# EAGLE design feld_hw (EAGLE 6.6.0)
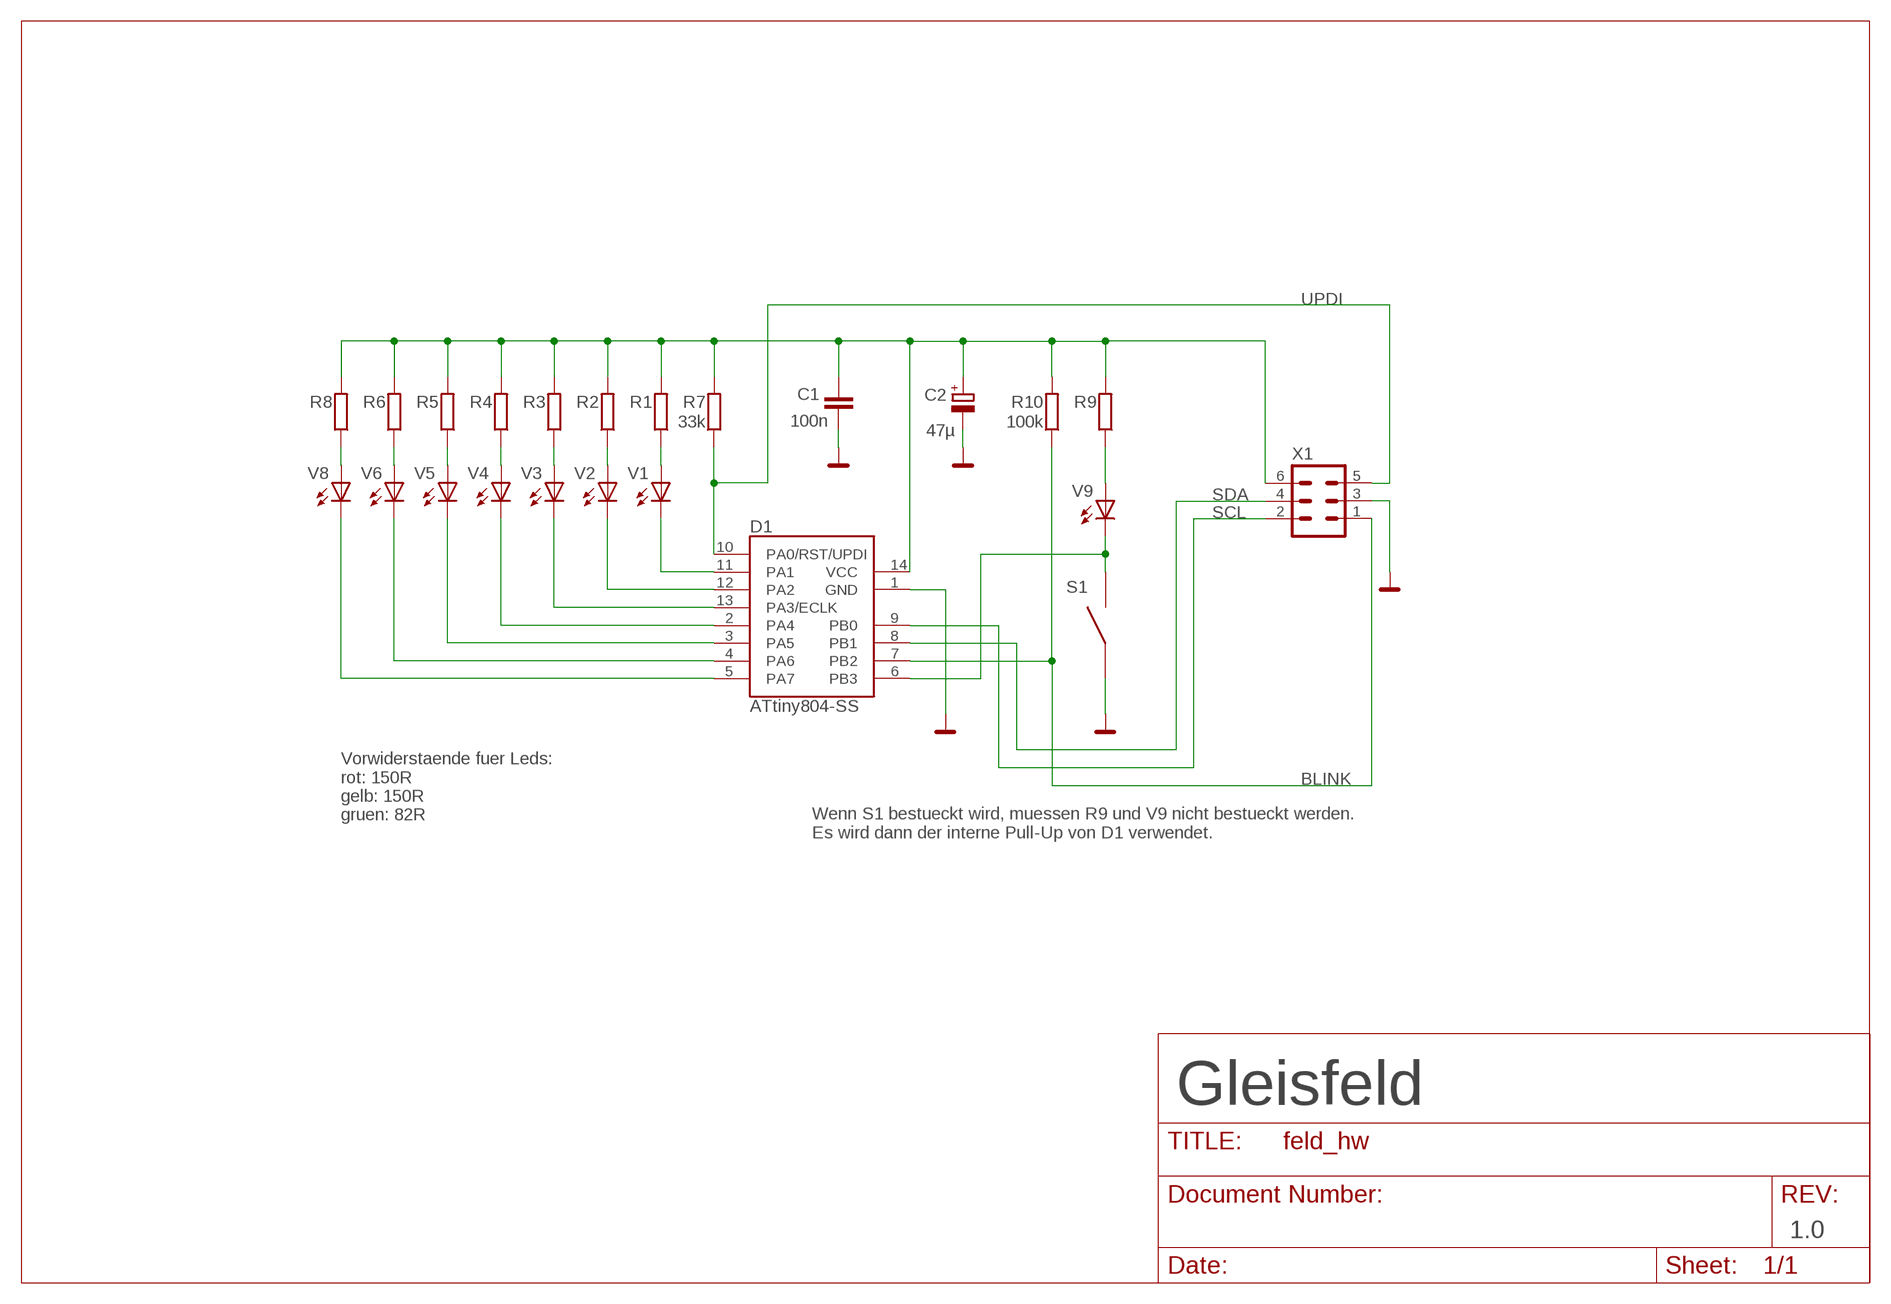
[diagram p0: schematic, sheet 1]

## Parts
C1  100n  C-EUC0805  [C0805]
C2  47µ  CPOL-EUCT7343  [CT7343]
D1  ATtiny804-SS  ATTINY204  [SOIC14]
R1  R-EU_R0805  [R0805]
R2  R-EU_R0805  [R0805]
R3  R-EU_R0805  [R0805]
R4  R-EU_R0805  [R0805]
R5  R-EU_R0805  [R0805]
R6  R-EU_R0805  [R0805]
R7  33k  R-EU_R0805  [R0805]
R8  R-EU_R0805  [R0805]
R9  R-EU_R0805  [R0805]
R10  100k  R-EU_R0805  [R0805]
S1  800SP9B5M2QEH  [ST811004]
V1  LEDPAD  [LED3MMPAD]
V2  LEDPAD  [LED3MMPAD]
V3  LEDPAD  [LED3MMPAD]
V4  LEDPAD  [LED3MMPAD]
V5  LEDPAD  [LED3MMPAD]
V6  LEDPAD  [LED3MMPAD]
V8  LEDPAD  [LED3MMPAD]
V9  LEDPAD  [LED3MMPAD]
X1  PINH2X3N  [MA03/2]

## Nets
BLINK: D1.7(PB2) R10.1 X1.1
GND: C1.1 C2.- D1.1(GND) S1.1 X1.3
N$1: D1.5(PA7) V8.P$2(C)
N$2: D1.4(PA6) V6.P$2(C)
N$3: D1.3(PA5) V5.P$2(C)
N$4: D1.2(PA4) V4.P$2(C)
N$5: D1.13(PA3/ECLK) V3.P$2(C)
N$6: D1.12(PA2) V2.P$2(C)
N$7: D1.11(PA1) V1.P$2(C)
N$8: R8.1 V8.P$1(A)
N$9: R6.1 V6.P$1(A)
N$10: R5.1 V5.P$1(A)
N$11: R4.1 V4.P$1(A)
N$12: R3.1 V3.P$1(A)
N$13: R2.1 V2.P$1(A)
N$14: R1.1 V1.P$1(A)
N$16: C1.2 C2.+ D1.14(VCC) R1.2 R2.2 R3.2 R4.2 R5.2 R6.2 R7.2 R8.2 R9.2 R10.2 X1.6
N$17: D1.6(PB3) S1.2 V9.P$2(C)
N$18: R9.1 V9.P$1(A)
SCL: D1.9(PB0) X1.2
SDA: D1.8(PB1) X1.4
UPDI: D1.10(PA0/RST/UPDI) R7.1 X1.5

## Notes on the sheet
- Vorwiderstaende fuer Leds:
  rot: 150R
  gelb: 150R
  gruen: 82R
- Wenn S1 bestueckt wird, muessen R9 und V9 nicht bestueckt werden.
  Es wird dann der interne Pull-Up von D1 verwendet.
- Gleisfeld
- 1.0

## Library data of the parts
C1 = rclwolfi:C-EU: CAPACITOR, European symbol
C2 = rclwolfi:CPOL-EU: POLARIZED CAPACITOR, European symbol
D1 = wolfi:ATTINY204
R1-R10 = rclwolfi:R-EU_: RESISTOR, European symbol
S1 = wolfi:800SP9B5M2QEH: E-Switch Series 800 Switch <https://www.e-switch.com/system/asset/product_line/data_sheet/29/800.pdf>
V1-V6 V8 V9 = opto:LED: LED OSRAM: - CHIPLED LG R971, LG N971, LY N971, LG Q971, LY Q971, LO R971, LY R971 LH N974, LH R974 LS Q976, LO Q976, LY Q976 LO Q996 - Hyper CHIPLED LW Q18S LB Q993, LB Q99A, LB R99A - SideLED LS A670, LO A670, LY A670, LG A670, LP A670 LB A673, LV A673, LT A673, LW A673 LH A674 LY A675 LS A676, LA A676, LO A676, LY A676, LW A676 LS A679, LY A679, LG A679 - Hyper Micro SIDELED® LS Y876, LA Y876, LO Y876, LY Y876 LT Y87S - SmartLED LW L88C, LW L88S LB L89C, LB L89S, LG L890 LS L89K, LO L89K, LY L89K LS L896, LA L896, LO L896, LY L896 - TOPLED LS T670, LO T670, LY T670, LG T670, LP T670 LSG T670, LSP T670, LSY T670, LOP T670, LYG T670 LG T671, LOG T671, LSG T671 LB T673, LV T673, LT T673, LW T673 LH T674 LS T676, LA T676, LO T676, LY T676, LB T676, LH T676, LSB T676, LW T676 LB T67C, LV T67C, LT T67C, LS T67K, LO T67K, LY T67K, LW E67C LS E67B, LA E67B, LO E67B, LY E67B, LB E67C, LV E67C, LT E67C LW T67C LS T679, LY T679, LG T679 LS T770, LO T770, LY T770, LG T770, LP T770 LB T773, LV T773, LT T773, LW T773 LH T774 LS E675, LA E675, LY E675, LS T675 LS T776, LA T776, LO T776, LY T776, LB T776 LHGB T686 LT T68C, LB T68C - Hyper Mini TOPLED® LB M676 - Mini TOPLED Santana® LG M470 LS M47K, LO M47K, LY M47K Source: http://www.osram.convergy.de LUXEON: - LUMILED® LXK2-PW12-R00, LXK2-PW12-S00, LXK2-PW14-U00, LXK2-PW14-V00 LXK2-PM12-R00, LXK2-PM12-S00, LXK2-PM14-U00 LXK2-PE12-Q00, LXK2-PE12-R00, LXK2-PE12-S00, LXK2-PE14-T00, LXK2-PE14-U00 LXK2-PB12-K00, LXK2-PB12-L00, LXK2-PB12-M00, LXK2-PB14-N00, LXK2-PB14-P00, LXK2-PB14-Q00 LXK2-PR12-L00, LXK2-PR12-M00, LXK2-PR14-Q00, LXK2-PR14-R00 LXK2-PD12-Q00, LXK2-PD12-R00, LXK2-PD12-S00 LXK2-PH12-R00, LXK2-PH12-S00 LXK2-PL12-P00, LXK2-PL12-Q00, LXK2-PL12-R00 Source: www.luxeon.com KINGBRIGHT: KA-3528ASYC Source: www.kingbright.com
X1 = wolfi:PINH2X3

## Board
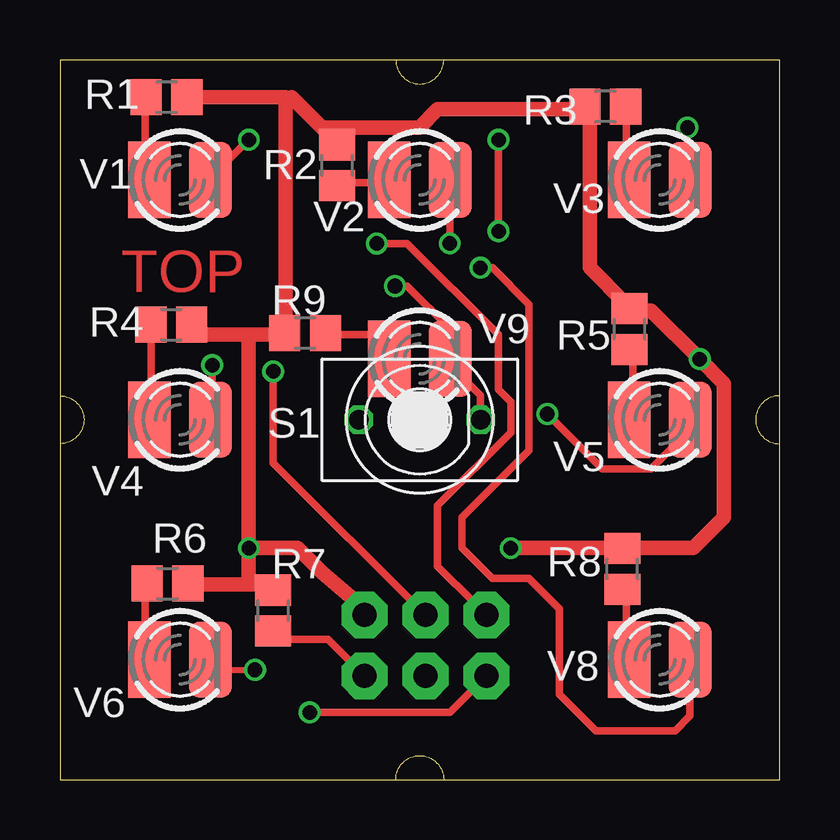
[diagram p1: board, top side]
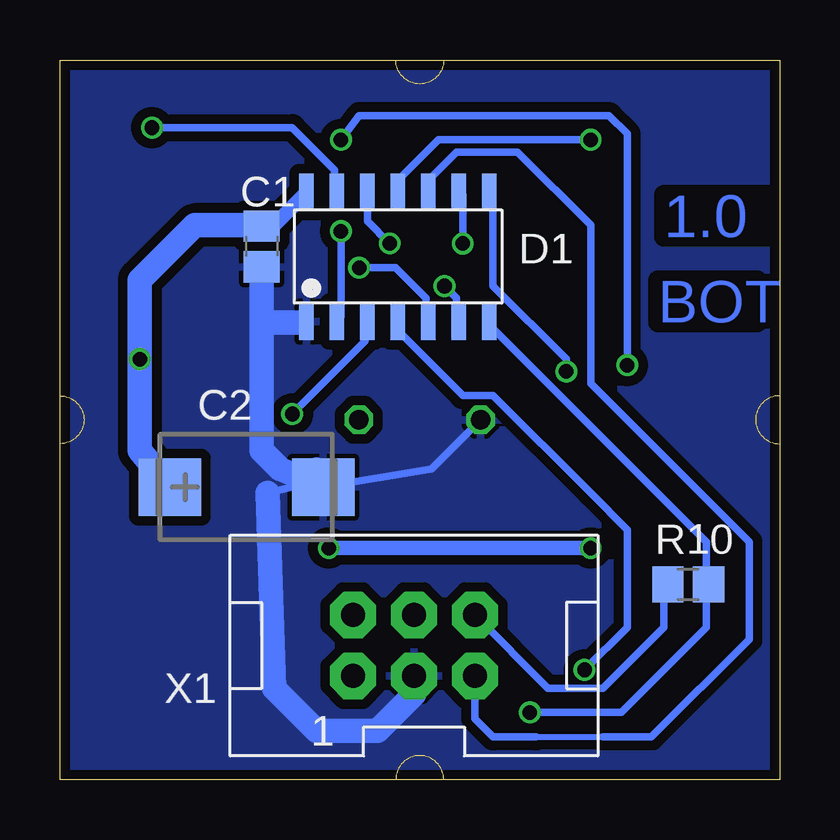
[diagram p2: board, bottom side, seen from below]

Size 30 x 30 mm. Coordinates in mm from the lower left corner, seen from the top.
Outline: 0,0 30,0 30,30 16,30 14,30 0,30 0,0
Copper layers (1*16): Top 0.018mm / dielectric 1.55mm / Bottom 0.018mm
Design rules "Multi-CB_2L_100Âµm-Tracks_OL35Âµm": minimum track width 0.1mm, minimum drill 0.2mm, track to track 0.1mm, track to pad 0.1mm, pad to pad 0.1mm, via to via 0.1mm, smd to smd 0mil, copper to edge 0.2mm, drill to drill 0.2mm, minimum pad ring 0.125mm, minimum via ring 0.1mm, stop-mask expansion 2mil, vias tented up to drill 0.45mm, thermal gap 0.2mm
Milling: 5 lines

### Footprints (pad centres in the part's own frame; a part is rotated, then mirrored left to right if it is on the bottom)
C0805 = smd 1.3 x 1.5: 1 -0.85,0; 2 0.85,0
CT7343 = smd 2.6 x 2.4: + -3.2,0; - 3.2,0
SOIC14 = smd 1.55 x 0.6: 1 0,0; 2 0,-1.27; 3 0,-2.54; 4 0,-3.81; 5 0,-5.08; 6 0,-6.35; 7 0,-7.62; 8 5.4,-7.62; 9 5.4,-6.35; 10 5.4,-5.08; 11 5.4,-3.81; 12 5.4,-2.54; 13 5.4,-1.27; 14 5.4,0
R0805 = smd 1.3 x 1.5: 1 -0.85,0; 2 0.85,0
ST811004 = drill 0.8 octagon: 1 -2.54,0; 2 2.54,0
LED3MMPAD = smd 1.778 x 3.175: P$1 -1.27,0; P$2 1.27,0
MA03/2 = drill 1 pad 1.93 octagon: 1 -2.54,-1.27; 2 -2.54,1.27; 3 0,-1.27; 4 0,1.27; 5 2.54,-1.27; 6 2.54,1.27

### Placement (x,y rotation side)
C1  21.59,22.23 90 bottom
C2  22.23,12.19 0 bottom
D1  19.73,19.09 90 bottom
R1  4.45,28.45 0 top
R2  11.56,25.61 90 top
R3  22.73,28.06 180 top
R4  4.64,18.96 0 top
R5  23.75,18.78 90 top
R6  4.48,8.18 0 top
R7  8.89,7.04 90 top
R8  23.45,8.78 90 top
R9  10.22,18.61 180 top
R10  3.81,8.13 180 bottom
S1  15,15 0 top
V1  5,25 0 top
V2  15,25 0 top
V3  25,25 0 top
V4  5,15 0 top
V5  25,15 0 top
V6  5,5 0 top
V8  25,5 0 top
V9  15,17.54 0 top
X1  15.24,5.59 0 bottom

### Tracks (layer width: path | path; a pad name or v marks a point on that pad's centre or on a via)
BLINK  (via drill 0.61)
  Top 0.305: X1.1 16.26,2.79 v10.41,2.79
  Bottom 0.254: 12.19,19.05 D1.7 | 3.05,7.37 3.05,8.13 R10.1
  Bottom 0.305: 3.05,8.13 3.05,9.91 12.19,19.05 | v10.41,2.79 6.6,2.79 3.05,6.35 3.05,7.37
GND
  Bottom 0.305: 21.34,11.94 19.3,12.45 | C2.- 14.51,12.95 S1.1 | D1.1 20.03,19.09 20.07,19.05
  Bottom 1.016: X1.3 15.24,3.56 16.76,2.03 19.3,2.03 21.08,3.81 21.34,11.94 | 19.3,12.45 19.3,12.93 C2.- 20.83,12.95 21.59,13.72 21.59,19.05 | 21.59,19.05 C1.1 | 21.59,19.05 21.55,19.09 21.51,19.05 20.07,19.05
  pour Bottom (isolate 0.406): 0.25,0.25 0.25,29.72 29.72,29.72 29.72,0.25 0.51,0.25
N$1  (via drill 0.61)
  Top 0.305: v17.53,21.34 18.03,21.34 19.56,19.81 19.56,13.72 16.76,10.92 16.76,9.65 18.03,8.38 19.56,8.38 20.83,7.11 20.83,3.56 22.35,2.03 25.65,2.03 26.27,2.65 V8.P$2
  Bottom 0.254: 14.73,19.81 14.73,19.3 D1.5
  Bottom 0.305: v17.53,21.34 16,21.34 14.73,20.07 14.73,19.81
N$2  (via drill 0.61)
  Top 0.254: v8.13,4.57 6.6,4.57 6.35,4.83 V6.P$2
  Bottom 0.254: 15.75,18.54 15.75,19.05 D1.4
  Bottom 0.305: 15.75,18.54 13.21,16 11.94,16 7.87,11.94 6.35,10.41 6.35,6.35 v8.13,4.57
N$3  (via drill 0.61)
  Top 0.254: 26.16,14.48 26.16,14.99 V5.P$2
  Top 0.305: v20.32,15.24 22.61,12.95 24.64,12.95 26.16,14.48
  Bottom 0.254: 17.27,18.29 17.27,19.05 D1.3
  Bottom 0.305: v20.32,15.24 17.27,18.29
N$4  (via drill 0.61)
  Top 0.254: 6.35,15.24 V4.P$2
  Top 0.305: v18.29,26.67 v18.29,22.86 | v6.35,17.27 6.35,15.08 V4.P$2
  Bottom 0.254: 18.29,19.3 D1.2
  Bottom 0.305: v18.29,22.86 18.29,19.3 | v18.29,26.67 17.53,27.69 7.11,27.69 6.35,26.92 v6.35,17.27
N$5  (via drill 0.61)
  Top 0.254: 26.16,25.15 V3.P$2
  Top 0.305: 26.16,25.15 v26.16,27.18
  Bottom 0.254: 18.54,24.64 D1.13
  Bottom 0.305: v26.16,27.18 20.32,27.18 18.54,25.4 18.54,24.64
N$6  (via drill 0.6)
  Top 0.254: 17.02,24.38 16.51,24.89 V2.P$2
  Top 0.305: v16.26,22.35 16.26,24.99 V2.P$2
  Bottom 0.305: D1.12 17.18,23.28 v16.26,22.35
N$7  (via drill 0.61)
  Top 0.254: 6.35,25.15 V1.P$2
  Top 0.305: 6.35,25.15 v7.87,26.67
  Bottom 0.254: 15.75,25.15 15.75,24.64 D1.11
  Bottom 0.305: 15.75,25.15 14.22,26.67 v7.87,26.67
N$8
  Top 0.254: 23.62,7.87 R8.1 | 23.62,5.08 V8.P$1
  Top 0.305: 23.62,5.08 23.62,7.87
N$9
  Top 0.254: 3.56,8.13 R6.1 | 3.56,5.08 V6.P$1
  Top 0.305: 3.56,5.08 3.56,8.13
N$10
  Top 0.254: 23.88,17.78 R5.1 | 23.88,15.24 V5.P$1
  Top 0.305: 23.88,15.24 23.88,17.78
N$11
  Top 0.254: 3.81,18.29 R4.1 | 3.81,15.24 V4.P$1
  Top 0.305: 3.81,15.24 3.81,18.29
N$12
  Top 0.254: 23.62,27.94 R3.1 | 23.62,25.15 V3.P$1
  Top 0.305: 23.62,25.15 23.62,27.94
N$13
  Top 0.254: 11.68,24.89 R2.1 | 13.72,24.89 V2.P$1
  Top 0.305: 13.72,24.89 11.68,24.89
N$14
  Top 0.254: 3.56,28.45 R1.1 | 3.56,25.15 V1.P$1
  Top 0.305: 3.56,25.15 3.56,28.45
N$16  (via drill 0.6, 0.61)
  Top 0.254: 23.62,9.65 R8.2 | 23.88,19.56 R5.2 23.62,19.81 | 22.1,27.94 R3.2 21.84,27.94 | 8.64,8.13 8.89,7.87 R7.2 8.89,7.62 | 5.33,8.13 R6.2 | 5.59,18.54 R4.2 | 9.14,18.54 R9.2 9.4,18.8 | 9.65,28.45 9.4,28.45 | 5.33,28.45 R1.2 | 11.43,26.67 11.18,26.92 R2.2 11.43,26.67
  Top 0.61: 23.88,19.56 24.64,19.56 v26.67,17.53 27.69,16.51 27.69,10.92 26.42,9.65 23.47,9.65 R8.2 23.42,9.65 v18.8,9.65 | 22.1,27.94 22.1,21.34 23.62,19.81 | 8.64,8.13 7.87,8.13 | 7.87,8.13 5.33,8.13 | 9.14,18.54 7.87,18.54 | 7.87,18.54 5.59,18.54 | 5.33,28.45 9.4,28.45 9.4,18.8 | 10.92,27.18 9.65,28.45 | 7.87,18.54 v7.87,9.65 | v7.87,9.65 7.87,8.13 | 21.84,27.94 15.75,27.94 14.99,27.18 10.92,27.18 | 11.18,26.92 10.92,27.18 | X1.6 12.7,7.11 10.92,8.64 9.91,9.65 v7.87,9.65
  Bottom 0.254: 21.59,23.11 C1.2 | 19.81,24.38 D1.14 | 21.59,22.86 22.1,22.86 | 4.83,8.13 R10.2
  Bottom 0.305: 22.1,22.86 21.84,23.11 | 4.83,8.13 4.83,6.35 7.37,3.81 9.65,3.81 X1.6
  Bottom 0.61: 21.59,23.11 21.08,23.11 19.81,24.38 | 21.59,22.86 C1.2 | v7.87,9.65 v18.8,9.65
  Bottom 1.016: C2.+ 26.67,13.72 v26.67,17.53 26.67,20.83 24.38,23.11 21.84,23.11
N$17  (via drill 0.61)
  Top 0.254: 16.26,18.8 16.26,17.78 V9.P$2 16.51,17.53 16.51,17.02
  Top 0.305: v13.97,20.57 14.48,20.57 16.26,18.8 | 16.51,17.02 17.53,16 17.53,15.24 S1.2
  Bottom 0.254: 13.46,19.3 D1.6
  Bottom 0.305: 13.46,19.3 13.46,20.07 v13.97,20.57
N$18
  Top 0.254: 12.95,18.54 13.72,17.78 V9.P$1 | 11.18,18.54 R9.1
  Top 0.305: 12.95,18.54 11.18,18.54
SCL  (via drill 0.61)
  Top 0.305: v13.21,22.35 14.48,22.35 18.29,18.54 18.29,17.27 18.29,16.26 18.8,15.75 18.8,14.48 15.75,11.43 15.75,8.89 17.27,7.37 X1.2
  Bottom 0.254: 13.21,24.38 D1.9
  Bottom 0.305: v13.21,22.35 13.21,24.38
SDA  (via drill 0.61)
  Top 0.305: v8.89,17.02 8.89,13.21 X1.4
  Bottom 0.254: 11.94,24.38 D1.8
  Bottom 0.305: 11.94,24.38 11.94,20.57 8.89,17.53 v8.89,17.02
UPDI
  Top 0.254: 8.89,5.84 R7.1
  Top 0.305: 8.89,5.84 11.18,5.84 X1.5
  Bottom 0.254: 14.48,25.15 14.48,24.64 D1.10 | 10.16,1.78 7.37,1.78
  Bottom 0.305: 14.48,25.15 13.46,26.16 10.92,26.16 7.87,23.11 7.87,16.51 1.27,9.91 1.27,5.84 5.33,1.78 7.37,1.78 | 10.16,1.78 11.94,1.78 12.7,2.54 X1.5

### Text on the board
Top: TOP
Bottom: 1.0 | BOT
tDocu: VCC | SDA | SCL | UPDI | BLINK | GND